# Altium schematic sheet Line.SchDoc
size A4
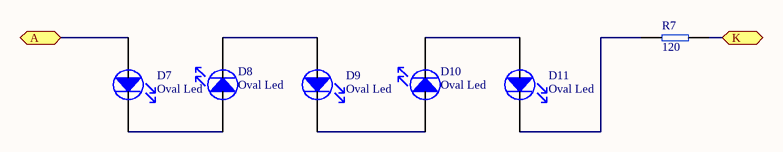
[diagram p0: Line.SchDoc]

## Parts
D7  Oval Led  [LED]
D8  Oval Led  [LED]
D9  Oval Led  [LED]
D10  Oval Led  [LED]
D11  Oval Led  [LED]
R7  value 120  [RES2512]  (hidden comment: RES120)

## Ports
A, K

## Nets
A: D7.A(Anode) ; port A
K: R7.2(neg) ; port K
NetD7_K: D7.K(Cathode) D8.A(Anode)
NetD8_K: D8.K(Cathode) D9.A(Anode)
NetD9_K: D9.K(Cathode) D10.A(Anode)
NetD10_K: D10.K(Cathode) D11.A(Anode)
NetD11_K: D11.K(Cathode) R7.1(pos)

## Library data of the parts
D7-D11 = Oval Led: LED estándar - Montaje interfacial Red Oval LED; MPN: C566C-RFN-CV0W0BB2; Value: 2200 mcd 70x35 deg; Supplier: Mouser; Supplier PN: 941-C566CRFNCV0W0BB2
R7 = RES120: Resistores de película gruesa - SMD 1watt 120ohms 5%; MPN: CRCW2512120RJNEG; Supplier: Mouser; Supplier PN: 71-CRCW2512J-120-E3